# EAGLE design ATtiny85Minimal (EAGLE 6.3)
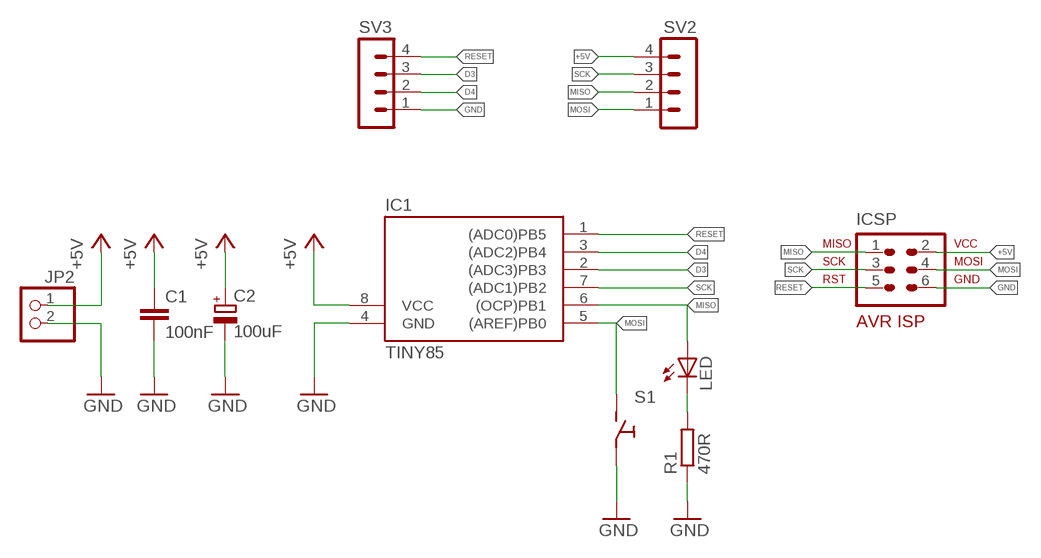
[diagram p0: schematic, sheet 1]

## Parts
C1  100nF  C-EU025-030X050  [C025-030X050]
C2  100uF  CPOL-EUE2-5  [E2-5]
IC1  TINY85  TINY25/45/85-20PU  [DIL08]
ICSP  AVR-ISP-6VERT  [AVR-ISP-6]
JP2  PINHD-1X2  [1X02]
LED  LED3MM  [LED3MM]
R1  470R  R-EU_0207/7  [0207/7]
S1  TASTER  [MICROSCHALTER]
SV2  MA04-1  [MA04-1]
SV3  MA04-1  [MA04-1]

## Nets
+5V: C1.1 C2.+ IC1.8(VCC) ICSP.2 JP2.1 SV2.4
D3: IC1.2((ADC3)PB3) SV3.3
D4: IC1.3((ADC2)PB4) SV3.2
GND: C1.2 C2.- IC1.4(GND) ICSP.6 JP2.2 R1.1 S1.P$2 SV3.1
MISO: IC1.6((OCP)PB1) ICSP.1 LED.A SV2.2
MOSI: IC1.5((AREF)PB0) ICSP.4 S1.P$1 SV2.1
N$1: LED.K(C) R1.2
RESET: IC1.1((ADC0)PB5) ICSP.5 SV3.4
SCK: IC1.7((ADC1)PB2) ICSP.3 SV2.3

## Library data of the parts
C1 = rcl:C-EU: CAPACITOR, European symbol
C2 = rcl:CPOL-EU: POLARIZED CAPACITOR, European symbol
IC1 = avr-7:TINY25/45/85
ICSP = avr-7:AVR-ISP-6: AVR ISP-6 Serial Programming Header
JP2 = pinhead:PINHD-1X2: PIN HEADER
LED = adafruit:LED: LED OSRAM: - CHIPLED LG R971, LG N971, LY N971, LG Q971, LY Q971, LO R971, LY R971 LH N974, LH R974 LS Q976, LO Q976, LY Q976 LO Q996 - Hyper CHIPLED LW Q18S LB Q993, LB Q99A, LB R99A - SideLED LS A670, LO A670, LY A670, LG A670, LP A670 LB A673, LV A673, LT A673, LW A673 LH A674 LY A675 LS A676, LA A676, LO A676, LY A676, LW A676 LS A679, LY A679, LG A679 - Hyper Micro SIDELED® LS Y876, LA Y876, LO Y876, LY Y876 LT Y87S - SmartLED LW L88C, LW L88S LB L89C, LB L89S, LG L890 LS L89K, LO L89K, LY L89K LS L896, LA L896, LO L896, LY L896 - TOPLED LS T670, LO T670, LY T670, LG T670, LP T670 LSG T670, LSP T670, LSY T670, LOP T670, LYG T670 LG T671, LOG T671, LSG T671 LB T673, LV T673, LT T673, LW T673 LH T674 LS T676, LA T676, LO T676, LY T676, LB T676, LH T676, LSB T676, LW T676 LB T67C, LV T67C, LT T67C, LS T67K, LO T67K, LY T67K, LW E67C LS E67B, LA E67B, LO E67B, LY E67B, LB E67C, LV E67C, LT E67C LW T67C LS T679, LY T679, LG T679 LS T770, LO T770, LY T770, LG T770, LP T770 LB T773, LV T773, LT T773, LW T773 LH T774 LS E675, LA E675, LY E675, LS T675 LS T776, LA T776, LO T776, LY T776, LB T776 LHGB T686 LT T68C, LB T68C - Hyper Mini TOPLED® LB M676 - Mini TOPLED Santana® LG M470 LS M47K, LO M47K, LY M47K Source: http://www.osram.convergy.de/
R1 = rcl:R-EU_: RESISTOR, European symbol
S1 = thomas:TASTER
SV2 SV3 = con-lstb:MA04-1: PIN HEADER; OC_FARNELL: unknown; OC_NEWARK: unknown

## Board
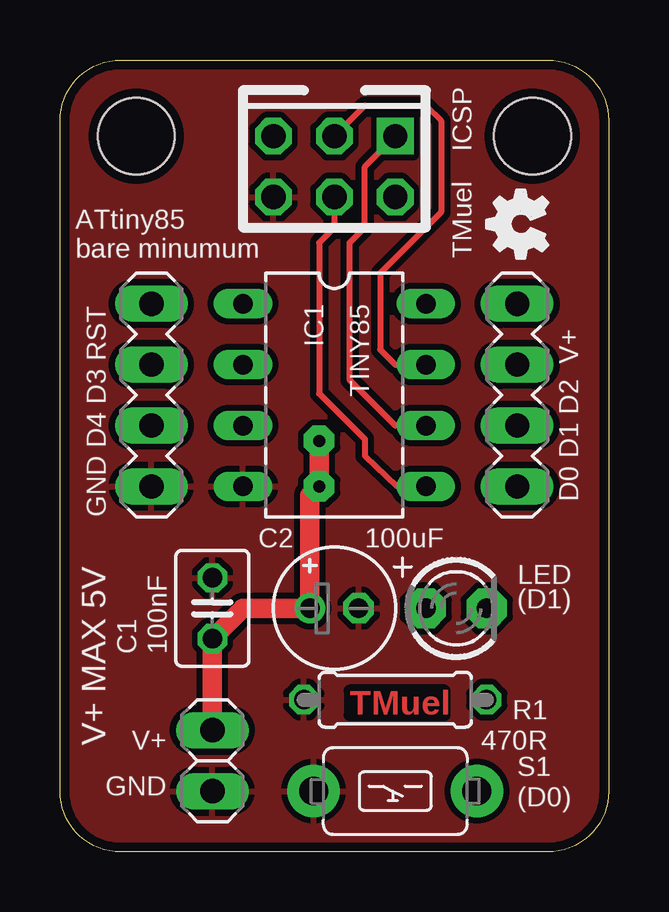
[diagram p1: board, top side]
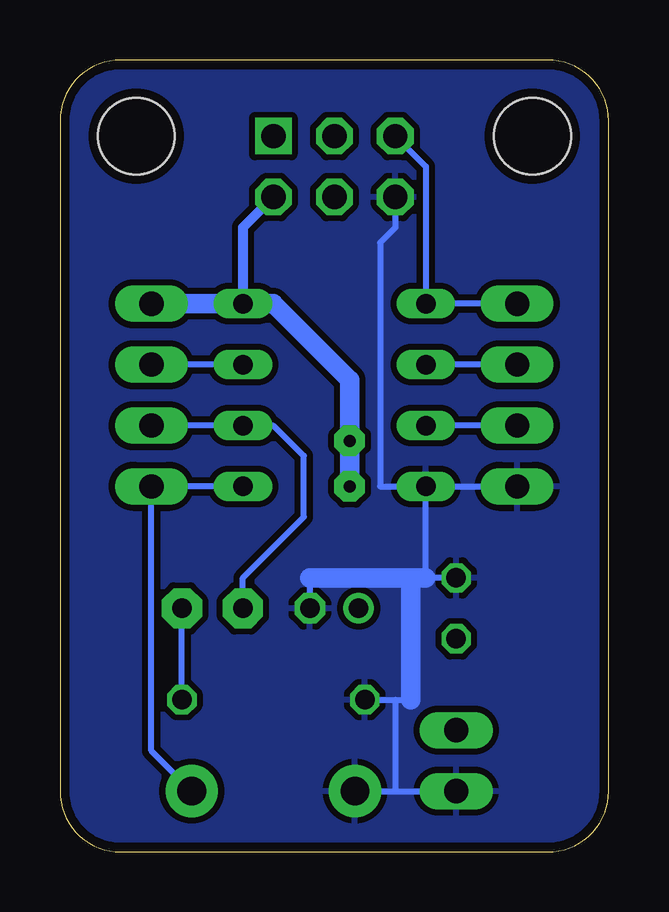
[diagram p2: board, bottom side, seen from below]

Size 22.86 x 33.02 mm. Coordinates in mm from the lower left corner, seen from the top.
Outline: 20.32,0 2.54,0 arc-90 0,2.54 0,30.48 arc-90 2.54,33.02 20.32,33.02 arc-90 22.86,30.48 22.86,2.54 arc-90 20.32,0
Copper layers (1*16): Top 0.0356mm / dielectric 1.5011mm / Bottom 0.0356mm
Design rules "LaenPCBOrder": minimum track width 6mil, minimum drill 13mil, track to track 6mil, track to pad 6mil, pad to pad 6mil, via to via 6mil, smd to smd 6mil, copper to edge 15mil, drill to drill 6mil, minimum pad ring 7mil, minimum via ring 7mil, stop-mask expansion 3mil, vias tented up to drill 0mil, thermal gap 10mil
Holes 3.2 mm at 3.17,29.84 19.68,29.84

### Footprints (pad centres in the part's own frame; a part is rotated, then mirrored left to right if it is on the bottom)
C025-030X050 = drill 0.813 octagon: 1 -1.27,0; 2 1.27,0
E2-5 = drill 0.813 pad 1.27: + -1.016,0 | drill 0.813 pad 1.27 octagon: - 1.016,0
DIL08 = drill 0.813 long: 1 -3.81,-3.81; 2 -1.27,-3.81; 3 1.27,-3.81; 4 3.81,-3.81; 5 3.81,3.81; 6 1.27,3.81; 7 -1.27,3.81; 8 -3.81,3.81
AVR-ISP-6 = drill 1.016 square: 1 -2.54,-1.27 | drill 1.016 octagon: 2 -2.54,1.27; 3 0,-1.27; 4 0,1.27; 5 2.54,-1.27; 6 2.54,1.27
1X02 = drill 1.016 long: 1 -1.27,0; 2 1.27,0
LED3MM = drill 0.813 pad 1.676 octagon: A -1.27,0; K 1.27,0
0207/7 = drill 0.813 octagon: 1 -3.81,0; 2 3.81,0
MICROSCHALTER = drill 1.2 pad 2.184: P$1 -3.4,0; P$2 3.4,0
MA04-1 = drill 1.016 long: 1 -3.81,0; 2 -1.27,0; 3 1.27,0; 4 3.81,0

### Placement (x,y rotation side)
C1  6.35,10.16 90 top
C2  11.43,10.16 0 top
IC1  11.43,19.05 270 top
ICSP  11.43,28.57 180 top
JP2  6.35,3.81 270 top
LED  16.51,10.16 0 top
R1  13.97,6.35 0 top
S1  13.97,2.54 180 top
SV2  19.05,19.05 90 top
SV3  3.81,19.05 90 top
U$6  [OSHW_FILLX100_NOTEXT]  20.32,24.77 90 top

### Tracks (layer width: path | path; a pad name or v marks a point on that pad's centre or on a via)
+5V  (via drill 0.5 pad 1.27)
  Top 0.813: JP2.1 C1.1 7.62,10.16 C2.+ 10.41,14.86 v10.79,15.24 v10.79,17.14
  Bottom 0.406: ICSP.2 15.24,26.04 IC1.8
  Bottom 0.813: SV2.4 IC1.8 13.97,22.86 10.79,19.68 v10.79,17.14 v10.79,15.24
D3
  Bottom 0.254: SV3.3 IC1.2
D4
  Bottom 0.254: SV3.2 IC1.3
GND
  Bottom 0.254: ICSP.6 8.89,26.04 9.53,25.4 9.53,15.24 IC1.4 | IC1.4 SV3.1 | 12.45,11.43 C2.- | C1.2 7.62,11.43 IC1.4 | S1.P$2 8.89,2.54 | 8.89,2.54 JP2.2 | R1.1 8.89,6.35 | 8.89,6.35 8.89,2.54 | 8.89,6.35 8.26,6.35
  Bottom 0.813: 8.26,6.35 8.26,11.43 | 7.62,11.43 8.26,11.43 | 8.26,11.43 12.45,11.43
  pour Bottom (isolate 0.254): 0,33.02 22.86,33.02 22.86,0 0,0
  pour Top (isolate 0.254): 0,33.02 22.86,33.02 22.86,0 0,0
MISO
  Top 0.254: IC1.6 13.97,17.78 12.06,19.68 12.06,25.4 12.7,26.04 12.7,28.57 ICSP.1
  Bottom 0.254: SV2.2 IC1.6 13.97,17.78 12.7,16.51 12.7,13.97 15.24,11.43 LED.A
MOSI
  Top 0.254: ICSP.4 11.43,26.04 10.79,25.4 10.79,19.11 12.7,17.21 12.7,16.51 14.03,15.24 IC1.5
  Bottom 0.254: IC1.5 SV2.1 19.05,4.22 S1.P$1
N$1
  Bottom 0.254: R1.2 LED.K
RESET
  Bottom 0.254: ICSP.5 7.62,28.57 IC1.1 SV3.4
SCK
  Top 0.254: ICSP.3 12.7,31.11 15.24,31.11 15.88,30.48 15.88,26.67 13.34,24.13 13.34,20.95 13.97,20.32 IC1.7
  Bottom 0.254: IC1.7 SV2.3

### Text on the board
Top: TMuel
tPlace: ATtiny85 / bare minumum | TMuel | D0 D1 D2 V+ | GND D4 D3 RST | (D1) | V+ | V+ MAX 5V | GND | S1 | (D0)